# Altium schematic sheet Extras.SchDoc
size A4; SheetNumber: 4; SheetTotal: 5
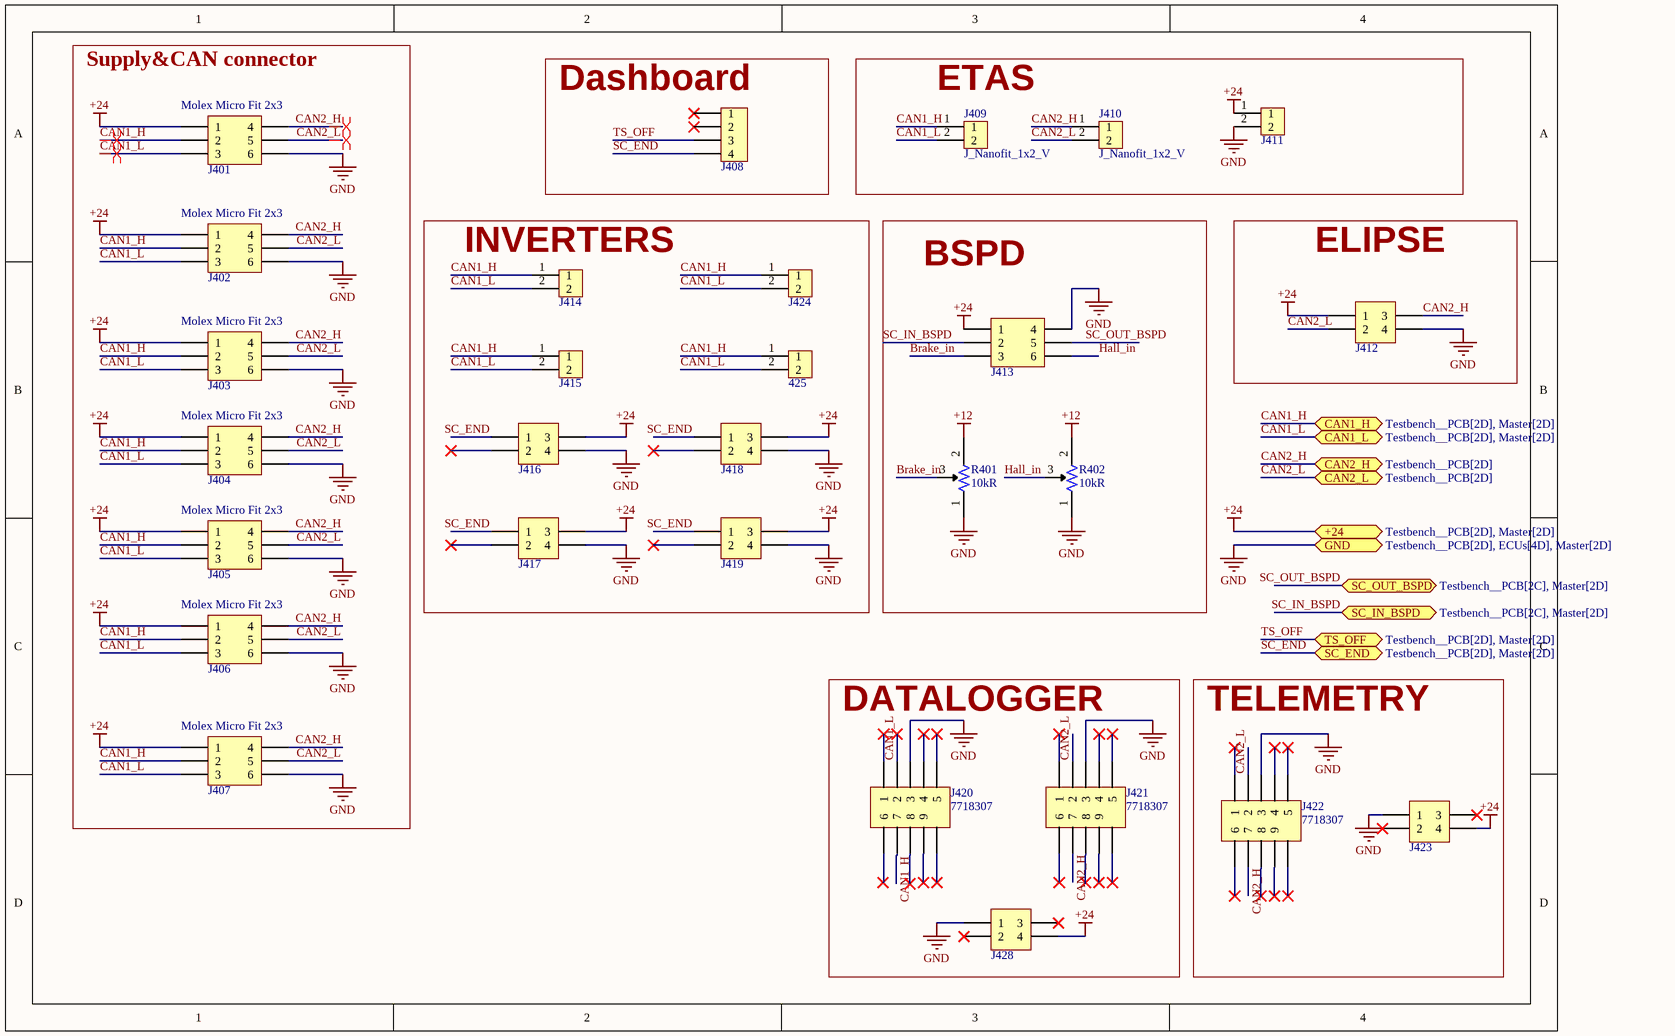
[diagram p0: Extras.SchDoc]

## Parts
425  436500215  [J_MicroFit_2x1]  (value not drawn)
J401  Molex Micro Fit 2x3  [J_MicroFit_2x3_V]
J402  Molex Micro Fit 2x3  [J_MicroFit_2x3_V]
J403  Molex Micro Fit 2x3  [J_MicroFit_2x3_V]
J404  Molex Micro Fit 2x3  [J_MicroFit_2x3_V]
J405  Molex Micro Fit 2x3  [J_MicroFit_2x3_V]
J406  Molex Micro Fit 2x3  [J_MicroFit_2x3_V]
J407  Molex Micro Fit 2x3  [J_MicroFit_2x3_V]
J408  1053091204  [J_NanoFit_1x4_V]  (value not drawn)
J409  J_Nanofit_1x2_V  [J_NanoFit_1X2_V]
J410  J_Nanofit_1x2_V  [J_NanoFit_1X2_V]
J411  436500215  [J_MicroFit_2x1]  (value not drawn)
J412  J_NanoFit_2x2  [J_NanoFit_2x2_v]  (value not drawn)
J413  43045-0612  [J_MicroFit_2x3_V]  (value not drawn)
J414  436500215  [J_MicroFit_2x1]  (value not drawn)
J415  436500215  [J_MicroFit_2x1]  (value not drawn)
J416  J_NanoFit_2x2  [J_NanoFit_2x2_v]  (value not drawn)
J417  J_NanoFit_2x2  [J_NanoFit_2x2_v]  (value not drawn)
J418  J_NanoFit_2x2  [J_NanoFit_2x2_v]  (value not drawn)
J419  J_NanoFit_2x2  [J_NanoFit_2x2_v]  (value not drawn)
J420  Supplier Part Number 1: 7718307  [J_VGA_CONNECTOR]  (hidden comment: 618009231221)
J421  Supplier Part Number 1: 7718307  [J_VGA_CONNECTOR]  (hidden comment: 618009231221)
J422  Supplier Part Number 1: 7718307  [J_VGA_CONNECTOR]  (hidden comment: 618009231221)
J423  J_NanoFit_2x2  [J_NanoFit_2x2_v]  (value not drawn)
J424  436500215  [J_MicroFit_2x1]  (value not drawn)
J428  J_NanoFit_2x2  [J_NanoFit_2x2_v]  (value not drawn)
R401  Resistance: 10kR  [R10k-VTR]  (hidden comment: 3296W-1-103LF)
R402  Resistance: 10kR  [R10k-VTR]  (hidden comment: 3296W-1-103LF)

## Blocks framed on the sheet
Supply&CAN connector: J401-J407
Dashboard: J408
ETAS: J409-J411
INVERTERS: 425 J414-J419 J424
BSPD: J413 R401 R402
ELIPSE: J412
DATALOGGER: J420 J421 J428
TELEMETRY: J422 J423

## Ports
+24 (bidir, see Testbench__PCB[2D], Master[2D]), CAN1_H (bidir, see Testbench__PCB[2D], Master[2D]), CAN1_L (bidir, see Testbench__PCB[2D], Master[2D]), CAN2_H (bidir, see Testbench__PCB[2D]), CAN2_L (bidir, see Testbench__PCB[2D]), GND (bidir, see Testbench__PCB[2D], ECUs[4D], Master[2D]), SC_END (bidir, see Testbench__PCB[2D], Master[2D]), SC_IN_BSPD (bidir, see Testbench__PCB[2C], Master[2D]), SC_OUT_BSPD (bidir, see Testbench__PCB[2C], Master[2D]), TS_OFF (bidir, see Testbench__PCB[2D], Master[2D])

## Nets
+12: R401.2 R402.2
+24: J401.1 J402.1 J403.1 J404.1 J405.1 J406.1 J407.1 J411.1 J412.1 J413.1 J416.3 J417.3 J418.3 J419.3 J423.4 J428.4 ; port +24
GND: J401.6 J402.6 J403.6 J404.6 J405.6 J406.6 J407.6 J411.2 J412.4 J413.4 J416.4 J417.4 J418.4 J419.4 J420.3 J421.3 J422.3 J423.1 J428.1 R401.1 R402.1 ; port GND
Brake_in: J413.3 R401.3
CAN1_H: 425.1 J401.2 J402.2 J403.2 J404.2 J405.2 J406.2 J407.2 J409.1 J414.1 J415.1 J420.7 J424.1 ; port CAN1_H
CAN1_L: 425.2 J401.3 J402.3 J403.3 J404.3 J405.3 J406.3 J407.3 J409.2 J414.2 J415.2 J420.2 J424.2 ; port CAN1_L
CAN2_H: J401.4 J402.4 J403.4 J404.4 J405.4 J406.4 J407.4 J410.1 J412.3 J421.7 J422.7 ; port CAN2_H
CAN2_L: J401.5 J402.5 J403.5 J404.5 J405.5 J406.5 J407.5 J410.2 J412.2 J421.2 J422.2 ; port CAN2_L
Hall_in: J413.6 R402.3
SC_END: J408.4 J416.1 J417.1 J418.1 J419.1 ; port SC_END
SC_IN_BSPD: J413.2 ; port SC_IN_BSPD
SC_OUT_BSPD: J413.5 ; port SC_OUT_BSPD
TS_OFF: J408.3 ; port TS_OFF

Not connected (* = marked no-connect by the designer): J408 1* 2*; J416 2*; J417 2*; J418 2*; J419 2*; J420 1* 4* 5* 6* 8* 9* SHIELD*; J421 1* 4* 5* 6* 8* 9* SHIELD*; J422 1* 4* 5* 6* 8* 9* SHIELD*; J423 2* 3*; J428 2* 3*

## Layout directives
differential pair: CAN1_H, CAN1_L, CAN2_H, CAN2_L

## Library data of the parts
425 J411 J414 J415 J424 = J_MicroFit_2x1: Header 1 Row Vertical Polarizing Peg 2 Pin SMT/Glow Wire Compatible Tin Plate; Manufacturer 1: Molex; Manufacturer Part Number 1: 43650-0215; Supplier 1: Arrow Electronics; RoHS: Yes; Category: Headers and Wire Housings; Stock 1: 11086; Pricing 1: 1=0,87800, 10=0,74400, 80=0,63070, 3264=0,47000, 6528=0,45100, 13056=0,41760 (USD); ComponentLink1URL: https://datasheet.ciiva.com/19462/884109-19462034.pdf?src-supplier=Jameco; ComponentLink1Description: https://datasheet.ciiva.com/19462/884109-19462034.pdf?src-supplier=Jameco; ComponentLink2URL: https://datasheet.ciiva.com/5157/0436500215-pcb-headers-148687-5157608.pdf?src-supplier=Mouser; ComponentLink2Description: https://datasheet.ciiva.com/5157/0436500215-pcb-headers-148687-5157608.pdf?src-supplier=Mouser; ComponentLink3URL: https://datasheet.ciiva.com/16085/0436500215-pcb-headers-16085668.pdf?src-supplier=Onlinecomponents.com; ComponentLink3Description: https://datasheet.ciiva.com/16085/0436500215-pcb-headers-16085668.pdf?src-supplier=Onlinecomponents.com; ComponentLink4URL: https://datasheet.ciiva.com/11748/0900766b80307ce2-11748388.pdf?src-supplier=RSComponents; ComponentLink4Description: https://datasheet.ciiva.com/11748/0900766b80307ce2-11748388.pdf?src-supplier=RSComponents; ComponentLink5URL: https://datasheet.ciiva.com/9432/0436500215-pcb-headers-9432850.pdf?src-supplier=Avnet; ComponentLink5Description: https://datasheet.ciiva.com/9432/0436500215-pcb-headers-9432850.pdf?src-supplier=Avnet; ComponentLink6URL: https://datasheet.ciiva.com/7920/1889390-7920892.pdf?src-supplier=Element14; ComponentLink6Description: https://datasheet.ciiva.com/7920/1889390-7920892.pdf?src-supplier=Element14; Supplier Part Number 1: 43650-0215
J401-J407 = J_MicroFit_2x3_V: Micro fit Header, 2 Row, Vertical, Polarizing Peg, 6 Pin, Tin Plate, SMT/Glow Wire, Kinked Leads; Manufacturer Part Number: 43045-0612; .Creator: DO; ComponentLink8Description: Where buy it; ComponentLink8URL: https://www.molex.com/molex/products/part-detail/pcb_headers/0430450612; Supplier 1: RSComponents; Manufacturer: Molex; RoHS: Yes; Category: Headers and Wire Housings; Stock 1: 2635; Pricing 1: 5=1,45500, 100=1,26700, 375=1,08900, 1500=0,90900, 3000=0,72900 (USD); ComponentLink1URL: https://www.molex.com/pdm_docs/sd/430450612_sd.pdf; ComponentLink1Description: Datasheet; ComponentLink2URL: https://datasheet.ciiva.com/11748/0900766b800bd7d2-11748707.pdf?src-supplier=RSComponents; ComponentLink2Description: https://datasheet.ciiva.com/11748/0900766b800bd7d2-11748707.pdf?src-supplier=RSComponents; ComponentLink3URL: https://datasheet.ciiva.com/19462/883464-19462371.pdf?src-supplier=Jameco; ComponentLink3Description: https://datasheet.ciiva.com/19462/883464-19462371.pdf?src-supplier=Jameco; ComponentLink4URL: https://datasheet.ciiva.com/30194/128550430450612-pcb-headers-30194512.pdf?src-supplier=Onlinecomponents.com; ComponentLink4Description: https://datasheet.ciiva.com/30194/128550430450612-pcb-headers-30194512.pdf?src-supplier=Onlinecomponents.com; ComponentLink5URL: https://datasheet.ciiva.com/9468/0430450612-pcb-headers-9468492.pdf?src-supplier=Avnet; ComponentLink5Description: https://datasheet.ciiva.com/9468/0430450612-pcb-headers-9468492.pdf?src-supplier=Avnet; Supplier Part Number 1: 2332898
J408 = J_NanoFit_1x4_V: Nano-Fit Vertical Header Through Hole 2.50mm Pitch Single Row 4 Circuits with Kinked Pins 0.38; Manufacturer 1: Molex; Manufacturer Part Number 1: 105309-1204; .Creator: DO; Supplier 1: Arrow Electronics; RoHS: No; Category: Headers and Wire Housings; Stock 1: 709; Pricing 1: 1=1,37050, 10=1,11700, 100=0,95270, 500=0,86980, 1000=0,74060, 2500=0,71930, 5000=0,68450, 10000=0,66860 (USD); ComponentLink1URL: http://farnell.com//datasheets/2221349.pdf?src-supplier=Farnell; ComponentLink1Description: http://farnell.com//datasheets/2221349.pdf?src-supplier=Farnell; ComponentLink2URL: http://www.farnell.com/datasheets/2221349.pdf?src-supplier=Newark; ComponentLink2Description: http://www.farnell.com/datasheets/2221349.pdf?src-supplier=Newark; ComponentLink3URL: http://www.literature.molex.com/SQLImages/kelmscott/Molex/PDF_Images/987651-1223.PDF?src-supplier=Digi-Key; ComponentLink3Description: http://www.literature.molex.com/SQLImages/kelmscott/Molex/PDF_Images/987651-1223.PDF?src-supplier=Digi-Key; ComponentLink4URL: http://www.farnell.com/datasheets/2059602.pdf?src-supplier=Element14; ComponentLink4Description: http://www.farnell.com/datasheets/2059602.pdf?src-supplier=Element14; Supplier Part Number 1: 105309-1204
J409 J410 = J_Nanofit_1x2_V: Nano-Fit Vertical Header, Through Hole, 2.50mm Pitch, Single Row, 2 Circuits, with Kinked Pins, Tin (Sn) Plating,...; Manufacturer: Molex; Manufacturer Part Number: 1053092202; Supplier 1: Mouser; RoHS: No; Stock 1: 6299; Pricing 1: 1=1,09, 10=0,839, 50=0,839, 100=0,686, 1000=0,571, 10000=0,507 (USD); Supplier Part Number 1: 538-105309-2202
J412 J416-J419 J423 J428 = J_NanoFit_2x2: Conn Nano-Fit Power HDR 4 POS 2.5mm Solder ST Through Hole 4 Terminal Single Port Tray; Manufacturer 1: Molex; Manufacturer Part Number 1: 1053101104; Supplier 1: Farnell; RoHS: Yes; Category: Uncategorized; Stock 1: 255; Pricing 1: 1=1,43000, 10=1,18000, 50=0,74900, 100=0,72900, 500=0,71400, 1000=0,70700 (EUR); ComponentLink1URL: https://www.molex.com/pdm_docs/ps/PS-105300-100-001.pdf?src-supplier=Digi-Key; ComponentLink1Description: https://www.molex.com/pdm_docs/ps/PS-105300-100-001.pdf?src-supplier=Digi-Key; Supplier Part Number 1: 2820681
J413 = J_MicroFit_2x3_V: Micro fit Header, 2 Row, Vertical, Polarizing Peg, 6 Pin, Tin Plate, SMT/Glow Wire, Kinked Leads; Manufacturer: Molex; .Creator: DO; ComponentLink8Description: Where buy it; ComponentLink8URL: https://www.molex.com/molex/products/part-detail/pcb_headers/0430450612; Supplier 1: RSComponents; Manufacturer Part Number: 43045-0612; RoHS: Yes; Category: Headers and Wire Housings; Stock 1: 2635; Pricing 1: 5=1,45500, 100=1,26700, 375=1,08900, 1500=0,90900, 3000=0,72900 (USD); ComponentLink1URL: https://www.molex.com/pdm_docs/sd/430450612_sd.pdf; ComponentLink1Description: Datasheet; ComponentLink2URL: https://datasheet.ciiva.com/11748/0900766b800bd7d2-11748707.pdf?src-supplier=RSComponents; ComponentLink2Description: https://datasheet.ciiva.com/11748/0900766b800bd7d2-11748707.pdf?src-supplier=RSComponents; ComponentLink3URL: https://datasheet.ciiva.com/19462/883464-19462371.pdf?src-supplier=Jameco; ComponentLink3Description: https://datasheet.ciiva.com/19462/883464-19462371.pdf?src-supplier=Jameco; ComponentLink4URL: https://datasheet.ciiva.com/30194/128550430450612-pcb-headers-30194512.pdf?src-supplier=Onlinecomponents.com; ComponentLink4Description: https://datasheet.ciiva.com/30194/128550430450612-pcb-headers-30194512.pdf?src-supplier=Onlinecomponents.com; ComponentLink5URL: https://datasheet.ciiva.com/9468/0430450612-pcb-headers-9468492.pdf?src-supplier=Avnet; ComponentLink5Description: https://datasheet.ciiva.com/9468/0430450612-pcb-headers-9468492.pdf?src-supplier=Avnet; Supplier Part Number 1: 2332898
J420-J422 = J_VGA_CONNECTOR: 9 Way Right Angle Through Hole PCB D-sub Connector Plug; 2.77mm; 2.84mm Pitch; Manufacturer: Wurth Electronics; Gender: Male; Current Rating: 3A; Voltage Rating: 125V; Number of Contacts: 9; Supplier 1: Rs; Manufacturer Part Number: 618009231221; RoHS: Yes; Category: D-Sub Connectors; Stock 1: 136; Pricing 1: 1=2,78, 10=2,59, 50=2,45, 100=2,3 (EUR); Mounting Technology: Through Hole; Contact Material: Copper Alloy; Contact Plating: Gold; Housing Material: Steel; Min Operating Temperature: -40°C; Max Operating Temperature: 85°C; Number of Rows: 2; Termination: SMD/SMT; Orientation: Right Angle; Series: 618; Length: 30.8mm; Width: 12.5mm; Depth: 18.5mm; Pitch: 2.84mm; RoHS Compliant: Yes; Reach SVHC Compliant: Unknown; ComponentLink1URL: https://datasheet.ciiva.com/12669/6180xx231221-12669204.pdf?src-supplier=Mouser; ComponentLink1Description: https://datasheet.ciiva.com/12669/6180xx231221-12669204.pdf?src-supplier=Mouser; ComponentLink2URL: https://datasheet.ciiva.com/25605/0900766b81191766-25605476.pdf?src-supplier=Rs; ComponentLink2Description: https://datasheet.ciiva.com/25605/0900766b81191766-25605476.pdf?src-supplier=Rs; ComponentLink3URL: https://datasheet.ciiva.com/1426/1442191-1426429.pdf?src-supplier=Element14; ComponentLink3Description: https://datasheet.ciiva.com/1426/1442191-1426429.pdf?src-supplier=Element14
R401 R402 = R10k-VTR: Trimmer, Cermet, Rest 10 Kilohms, PCB, 25 Turns, Pwr-Rtg 0.5W, 3296 Series; Manufacturer: Bourns; Tolerance: 10%; Power Rating: 500mW; Number of Turns: 25; Temperature Coefficient: 100ppm/°C; Insulation Resistance: 1GR; .Creator: DO; Supplier 1: RSComponents; Manufacturer Part Number: 3296W-1-103LF; RoHS: Yes; Category: Variable Resistors and Potentiometers; Stock 1: 3300; Pricing 1: 50=2,54800, 100=2,31900, 200=2,14000, 300=1,88400, 500=1,55300 (USD); Mount: PCB,Through Hole; Weight: 0.03oz; Color: Blue; Contact Plating: Tin,Matte; Min Operating Temperature: -55°C; Max Operating Temperature: 125°C; Packaging: Rail/Tube; Package Quantity: 50; Termination: Pin; Resistor Type: Cermet; Technology: CERMET; Taper: Linear; Max Power Dissipation: 500mW; Series: 3296; Resistance Tolerance: 10%; Length: 9.53mm; Width: 9.53mm; Height: 0.395inch; Depth: 4.83mm; Radiation Hardening: No; REACH SVHC: No SVHC; Military Standard: Not; Lead Free: Lead Free; RoHS Compliant: Yes; ComponentLink1URL: https://datasheet.ciiva.com/19454/853572-19454866.pdf?src-supplier=Jameco; ComponentLink1Description: https://datasheet.ciiva.com/19454/853572-19454866.pdf?src-supplier=Jameco; ComponentLink2URL: https://datasheet.ciiva.com/11830/0900766b8069ccf4-11830871.pdf?src-supplier=RSComponents; ComponentLink2Description: https://datasheet.ciiva.com/11830/0900766b8069ccf4-11830871.pdf?src-supplier=RSComponents; ComponentLink3URL: https://datasheet.ciiva.com/29122/447277-da-01-en-trimmer-tht3296w-1-103lf-10k-0-5w-29122362.pdf?src-supplier=Conrad; ComponentLink3Description: https://datasheet.ciiva.com/29122/447277-da-01-en-trimmer-tht3296w-1-103lf-10k-0-5w-29122362.pdf?src-supplier=Conrad; ComponentLink4URL: https://datasheet.ciiva.com/26913/3296w-1-103lf-26913885.pdf?src-supplier=IIIC; ComponentLink4Description: https://datasheet.ciiva.com/26913/3296w-1-103lf-26913885.pdf?src-supplier=IIIC; ComponentLink5URL: https://datasheet.ciiva.com/1131/1815117-1131273.pdf?src-supplier=Element14; ComponentLink5Description: https://datasheet.ciiva.com/1131/1815117-1131273.pdf?src-supplier=Element14; ComponentLink6URL: https://datasheet.ciiva.com/18411/70153578-18411561.pdf?src-supplier=Allied+Electronics; ComponentLink6Description: https://datasheet.ciiva.com/18411/70153578-18411561.pdf?src-supplier=Allied+Electronics; ComponentLink7URL: https://datasheet.ciiva.com/3266/3296-3266187.pdf?src-supplier=Avnet; ComponentLink7Description: https://datasheet.ciiva.com/3266/3296-3266187.pdf?src-supplier=Avnet; ComponentLink8URL: https://datasheet.ciiva.com/30093/3296-30093899.pdf?src-supplier=Onlinecomponents.com; ComponentLink8Description: https://datasheet.ciiva.com/30093/3296-30093899.pdf?src-supplier=Onlinecomponents.com; ComponentLink9URL: https://datasheet.ciiva.com/2156/3296-2156893.pdf?src-supplier=Digi-Key; ComponentLink9Description: https://datasheet.ciiva.com/2156/3296-2156893.pdf?src-supplier=Digi-Key; ComponentLink10URL: https://datasheet.ciiva.com/14173/ew3296-dat-e-14173022.pdf?src-supplier=Distrelec; ComponentLink10Description: https://datasheet.ciiva.com/14173/ew3296-dat-e-14173022.pdf?src-supplier=Distrelec; Supplier Part Number 1: 1673377; ComponentLink11Description: Where buy it; ComponentLink11URL: https://es.rs-online.com/web/p/potenciometros-de-ajuste/5219647